# EAGLE design RCM-Comm_v3_W (EAGLE 7.6.0)
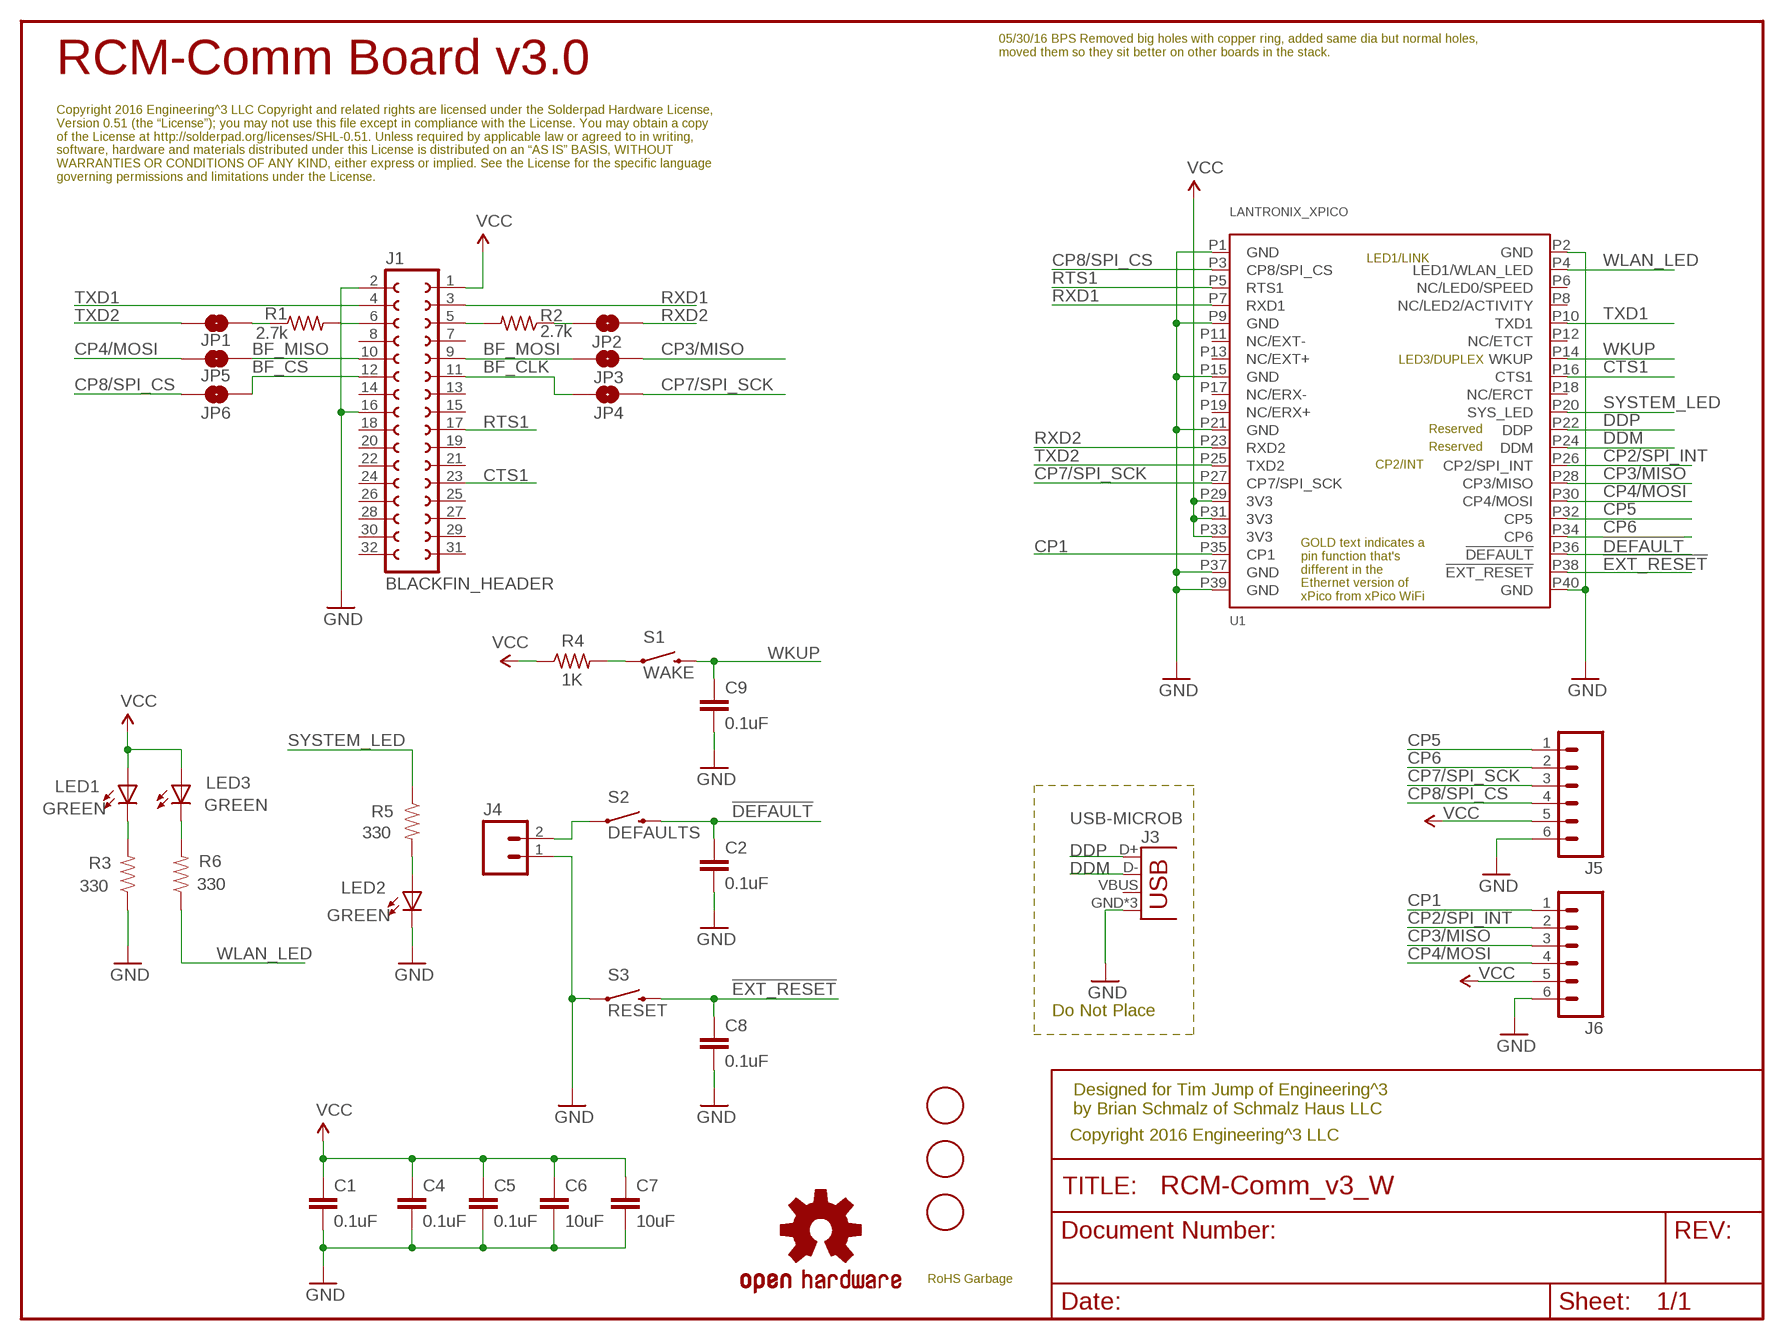
[diagram p0: schematic, sheet 1]

## Parts
C1  0.1uF  0.1UF-25V(+80/-20%)(0603)  [0603-CAP]
C2  0.1uF  0.1UF-25V(+80/-20%)(0603)  [0603-CAP]
C4  0.1uF  0.1UF-25V(+80/-20%)(0603)  [0603-CAP]
C5  0.1uF  0.1UF-25V(+80/-20%)(0603)  [0603-CAP]
C6  10uF  10UF-6.3V-20%(0603)  [0603-CAP]
C7  10uF  10UF-6.3V-20%(0603)  [0603-CAP]
C8  0.1uF  0.1UF-25V(+80/-20%)(0603)  [0603-CAP]
C9  0.1uF  0.1UF-25V(+80/-20%)(0603)  [0603-CAP]
FID1  FIDUCIAL  [FIDUCIAL_1MM]
FID2  FIDUCIAL  [FIDUCIAL_1MM]
FID3  FIDUCIAL  [FIDUCIAL_1MM]
J1  BLACKFIN_HEADER  [2X16]
J3  USB-MICROB  [USB-MICROB]
J4  M02LOCK  [1X02_LOCK]
J5  M06LOCK  [1X06_LOCK]
J6  M06LOCK  [1X06_LOCK]
JP1  JUMPER-PAD-2-NOROUND  [PAD-JUMPER-2-NO_YES_SILK_ROUND]
JP2  JUMPER-PAD-2-NOROUND  [PAD-JUMPER-2-NO_YES_SILK_ROUND]
JP3  JUMPER-PAD-2-NOROUND  [PAD-JUMPER-2-NO_YES_SILK_ROUND]
JP4  JUMPER-PAD-2-NOROUND  [PAD-JUMPER-2-NO_YES_SILK_ROUND]
JP5  JUMPER-PAD-2-NOROUND  [PAD-JUMPER-2-NO_YES_SILK_ROUND]
JP6  JUMPER-PAD-2-NOROUND  [PAD-JUMPER-2-NO_YES_SILK_ROUND]
LED1  GREEN  LED0603  [LED-0603]
LED2  GREEN  LED0603  [LED-0603]
LED3  GREEN  LED0603  [LED-0603]
LOGO1  OSHW-LOGOM  [OSHW-LOGO-M]
R1  2.7k  R-US_R0603  [R0603]
R2  2.7k  R-US_R0603  [R0603]
R3  330  RESISTOR0603-RES  [0603-RES]
R4  1K  R-US_R0603  [R0603]
R5  330  RESISTOR0603-RES  [0603-RES]
R6  330  RESISTOR0603-RES  [0603-RES]
S1  WAKE  SWITCH-MOMENTARY-2SMD  [TACTILE-SWITCH-SMD]
S2  DEFAULTS  SWITCH-MOMENTARY-2SMD  [TACTILE-SWITCH-SMD]
S3  RESET  SWITCH-MOMENTARY-2SMD  [TACTILE-SWITCH-SMD]
U1  LANTRONIX_XPICO  [LANTRONIX_XPICO]
U$3  ROHS_GARBAGE  [ROHS_GARBAGE_5MM]

## Nets
!DEFAULT!: C2.1 S2.3 U1.P36(!DEFAULT!)
!EXT_RESET!: C8.1 S3.3 U1.P38(!EXT_RESET!)
BF_CLK: J1.11(SPI_SCK) JP4.1
BF_CS: J1.12(SPI_SEL) JP6.2
BF_MISO: J1.10(SPI_MISO) JP5.2
BF_MOSI: J1.9(SPI_MOSI) JP3.1
CP1: J6.1 U1.P35(CP1)
CP2/SPI_INT: J6.2 U1.P26(CP2/SPI_INT)
CP3/MISO: J6.3 JP3.2 U1.P28(CP3/MISO)
CP4/MOSI: J6.4 JP5.1 U1.P30(CP4/MOSI)
CP5: J5.1 U1.P32(CP5)
CP6: J5.2 U1.P34(CP6)
CP7/SPI_SCK: J5.3 JP4.2 U1.P27(CP7/SPI_SCK)
CP8/SPI_CS: J5.4 JP6.1 U1.P3(CP8/SPI_CS)
CTS1: J1.23(GP6) U1.P16(CTS1)
DDM: J3.D- U1.P24(DDM)
DDP: J3.D+ U1.P22(DDP)
GND: C1.2 C2.2 C4.2 C5.2 C6.2 C7.2 C8.2 C9.2 J1.2(GND) J1.16(GND16) J3.GND J3.MT1(GND) J3.MT2(GND) J4.1 J5.6 J6.6 LED2.C R3.1 S3.1 U1.P1(GND) U1.P2(GND) U1.P9(GND) U1.P15(GND) U1.P21(GND) U1.P37(GND) U1.P39(GND) U1.P40(GND)
N$1: J4.2 S2.1
N$2: JP1.2 R1.1
N$3: LED1.C R3.2
N$4: JP2.1 R2.1
N$5: R4.2 S1.1
N$6: LED2.A R5.2
N$8: LED3.C R6.2
N$24: J1.6(RX1) R1.2
N$26: J1.5(TX1) R2.2
RTS1: J1.17(GP0) U1.P5(RTS1)
RXD1: J1.3(TX0) U1.P7(RXD1)
RXD2: JP2.2 U1.P23(RXD2)
SYSTEM_LED: R5.1 U1.P20(SYS_LED)
TXD1: J1.4(RX0) U1.P10(TXD1)
TXD2: JP1.1 U1.P25(TXD2)
VCC: C1.1 C4.1 C5.1 C6.1 C7.1 J1.1(3.3V) J5.5 J6.5 LED1.A LED3.A R4.1 U1.P29(3V3) U1.P31(3V3) U1.P33(3V3)
WKUP: C9.1 S1.3 U1.P14(WKUP)
WLAN_LED: R6.1 U1.P4(LED1/WLAN_LED)
Unconnected: J1.7(TMR2) J1.8(TMR3) J1.13(SPI_SEL2) J1.14(SPI_SCL) J1.15(I2C_SDA) J1.18(GP1) J1.19(GP2) J1.20(GP3) J1.21(GP4) J1.22(GP5) J1.24(GP7) J1.25(GP8) J1.26(GP9) J1.27(GPA) J1.28(GPB) J1.29(GPC) J1.30(GPD) J1.31(GPE) J1.32(GPF) J3.VBUS U1.P6(NC/LED0/SPEED) U1.P8(NC/LED2/ACTIVITY) U1.P11(NC/EXT-) U1.P12(NC/ETCT) U1.P13(NC/EXT+) U1.P17(NC/ERX-) U1.P18(NC/ERCT) U1.P19(NC/ERX+)

## Notes on the sheet
- 05/30/16 BPS Removed big holes with copper ring, added same dia but normal holes, 
  moved them so they sit better on other boards in the stack.
- RCM-Comm Board v3.0
- Copyright 2016 Engineering^3 LLC Copyright and related rights are licensed under the Solderpad Hardware License, 
  Version 0.51 (the “License”); you may not use this file except in compliance with the License. You may obtain a copy 
  of the License at http://solderpad.org/licenses/SHL-0.51. Unless required by applicable law or agreed to in writing, 
  software, hardware and materials distributed under this License is distributed on an “AS IS” BASIS, WITHOUT 
  WARRANTIES OR CONDITIONS OF ANY KIND, either express or implied. See the License for the specific language 
  governing permissions and limitations under the License.
- Do Not Place
- Designed for Tim Jump of Engineering^3
  by Brian Schmalz of Schmalz Haus LLC
- Copyright 2016 Engineering^3 LLC

## Library data of the parts
C1 C2 C4 C5 C8 C9 = SparkFun-Capacitors:0.1UF-25V(+80/-20%)(0603): CAP-00810 Ceramic Standard decoupling cap; PROD_ID: CAP-00810
C6 C7 = SparkFun-Capacitors:10UF-6.3V-20%(0603): CAP-11015; PROD_ID: CAP-11015
FID1-FID3 = adafruit:FIDUCIAL: For use by pick and place machines to calibrate the vision/machine, 1mm By microbuilder.eu
J1 = Surveyor:BLACKFIN_HEADER
J3 = SparkFun-Connectors:USB: USB Connectors USB-B-PTH is fully proven SKU : PRT-00139/CONN-08278 USB-miniB is fully proven SKU : PRT-00587 USB-A-PCB is untested. USB-A-H is throughly reviewed, but untested. Spark Fun Electronics SKU : PRT-00437 USB-B-SMT is throughly reviewed, but untested. Needs silkscreen touching up. USB-A-S has not been used/tested USB-MB-H has not been used/tested USB-MICROB has been used. CONN-09505; PROD_ID: CONN-09505
J4 = SparkFun-Connectors:M02: Standard 2-pin 0.1" header. Use with - straight break away headers ( PRT-00116) - right angle break away headers (PRT-00553) - swiss pins (PRT-00743) - machine pins (PRT-00117) - female headers (PRT-00115) Molex polarized connector foot print use with: PRT-08233 with associated crimp pins and housings. 2.54_SCREWTERM for use with PRT-10571. 3.5mm Screw Terminal footprints for PRT-08084 5mm Screw Terminal footprints for use with PRT-08432
J5 J6 = SparkFun-Connectors:M06: Header 6 Standard 6-pin 0.1" header. Use with straight break away headers (SKU : PRT-00116), right angle break away headers (PRT-00553), swiss pins (PRT-00743), machine pins (PRT-00117), and female headers (PRT-00115). Molex polarized connector foot print use with SKU : PRT-08094 with associated crimp pins and housings. NOTES ON THE VARIANTS LOCK and LOCK_LONGPADS... This footprint was designed to help hold the alignment of a through-hole component (i.e. 6-pin header) while soldering it into place. You may notice that each hole has been shifted either up or down by 0.005 of an inch from it's more standard position (which is a perfectly straight line). This slight alteration caused the pins (the squares in the middle) to touch the edges of the holes. Because they are alternating, it causes a "brace" to hold the component in place. 0.005 has proven to be the perfect amount of "off-center" position when using our standard breakaway headers. Although looks a little odd when you look at the bare footprint, once you have a header in there, the alteration is very hard to notice. Also,if you push a header all the way into place, it is covered up entirely on the bottom side. This idea of altering the position of holes to aid alignment will be further integrated into the Sparkfun Library for other footprints. It can help hold any component with 3 or more connection pins.
JP1-JP6 = SparkFun-Passives:JUMPER-PAD-2-NO
LED1-LED3 = spark_fun:LED: LEDs Standard schematic elements and footprints for 5mm, 3mm, 1206, and 0603 sized LEDs. 5mm - Spark Fun Electronics SKU : COM-00529 (and others)
LOGO1 = SparkFun-Aesthetics:OSHW-LOGO: Open Source Hardware Logo This logo indicates the piece of hardware it is found on incorporates a OSHW license and/or adheres to the definition of open source hardware found here: http://freedomdefined.org/OSHW
R1 R2 R4 = rcl:R-US_: RESISTOR, American symbol
R3 R5 R6 = spark_fun:RESISTOR: Resistor Basic schematic elements and footprints for 0603, 1206, and PTH resistors.
S1-S3 = SparkFun-Electromechanical:SWITCH-MOMENTARY-2: Various NO switches- pushbuttons, reed, etc; PROD_ID: SWCH-08247
U1 = xPico:LANTRONIX_XPICO
U$3 = SchmalzHausPublic:ROHS_GARBAGE

## Board
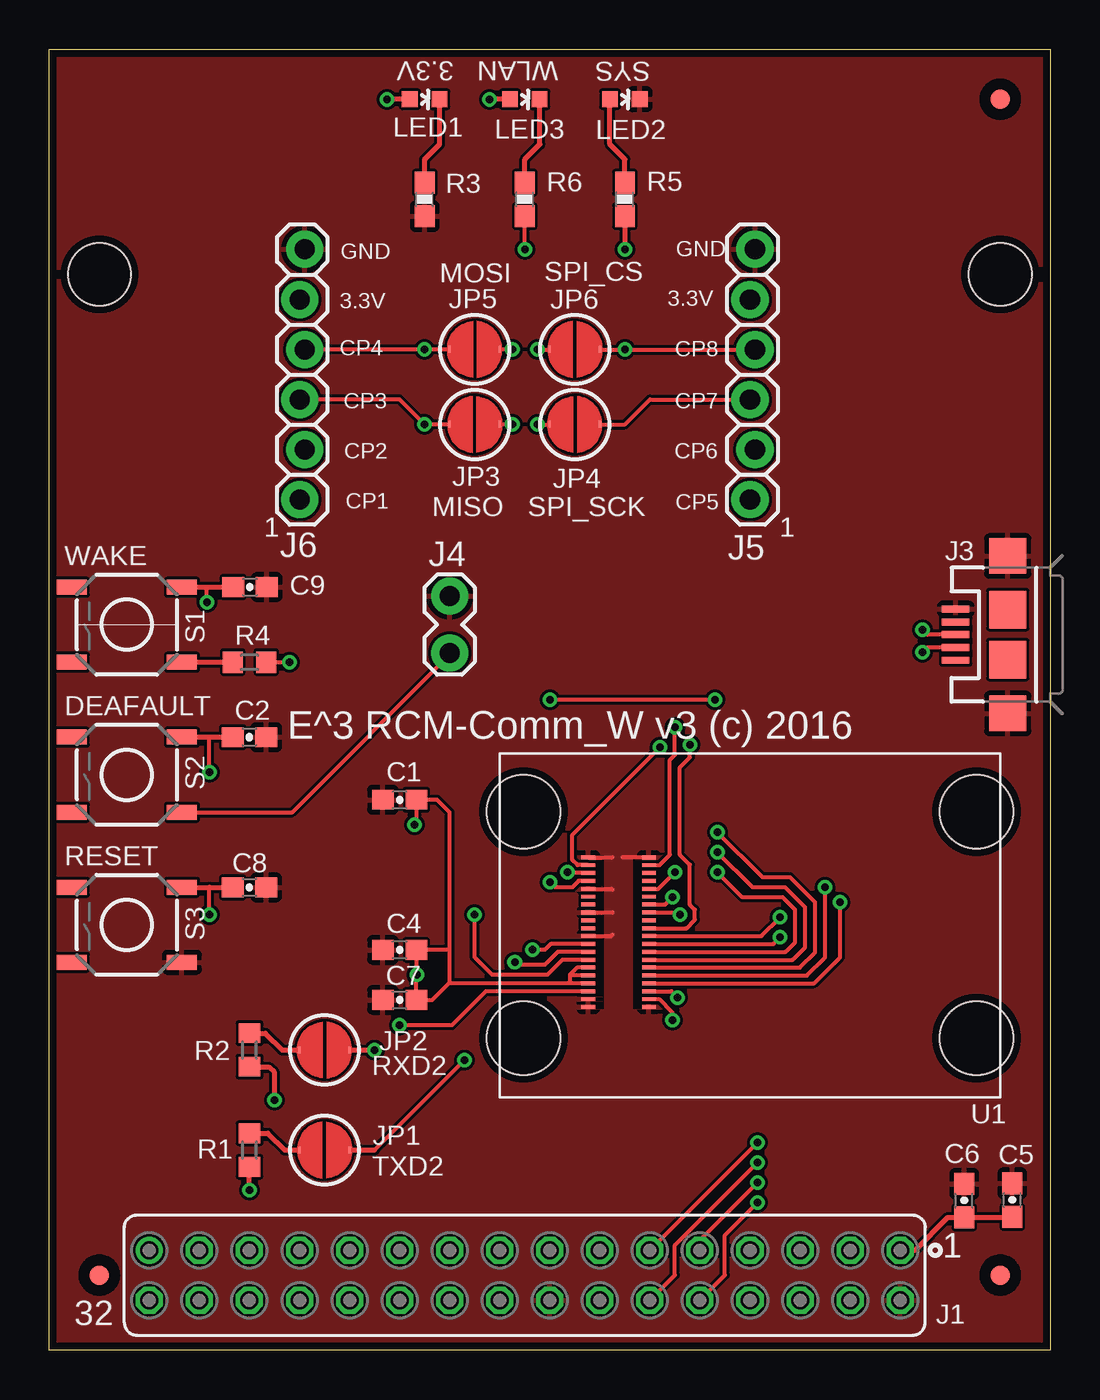
[diagram p1: board, top side]
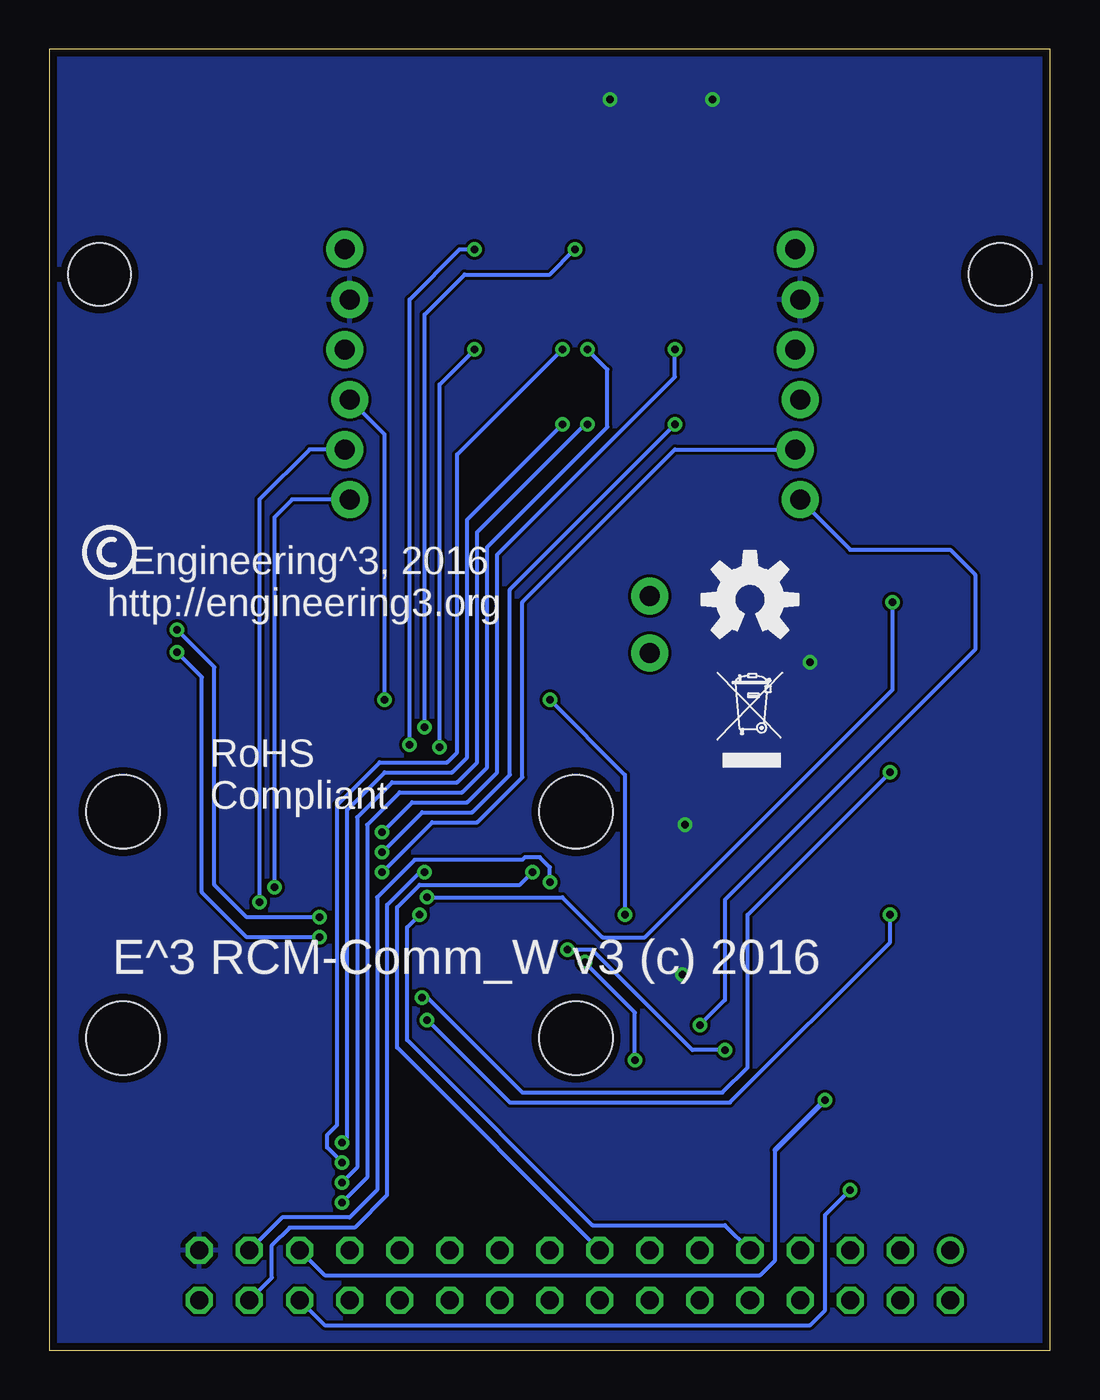
[diagram p2: board, bottom side, seen from below]

Size 50.8 x 66.05 mm. Coordinates in mm from the lower left corner, seen from the top.
Outline: 0,66.05 50.8,66.05 50.8,43.69 50.8,0 0,0.01 0,66.05
Copper layers (1*16): Top 0.0356mm / dielectric 1.5011mm / Bottom 0.0356mm
Design rules "LaenPCBOrder": minimum track width 6mil, minimum drill 13mil, track to track 6mil, track to pad 6mil, pad to pad 6mil, via to via 6mil, smd to smd 6mil, copper to edge 15mil, drill to drill 6mil, minimum pad ring 7mil, minimum via ring 7mil, stop-mask expansion 3mil, vias tented up to drill 25mil, thermal gap 10mil
Holes 3.17 mm at 2.54,54.62 48.26,54.62

### Footprints (pad centres in the part's own frame; a part is rotated, then mirrored left to right if it is on the bottom)
0603-CAP = smd 1.1 x 1: 1 -0.85,0; 2 0.85,0
FIDUCIAL_1MM = smd 1 x 1: 1 0,0
2X16 = drill 0.914 octagon: 1 20.32,1.27; 2 20.32,-1.27; 3 17.78,1.27; 4 17.78,-1.27; 5 15.24,1.27; 6 15.24,-1.27; 7 12.7,1.27; 8 12.7,-1.27; 9 10.16,1.27; 10 10.16,-1.27; 11 7.62,1.27; 12 7.62,-1.27; 13 5.08,1.27; 14 5.08,-1.27; 15 2.54,1.27; 16 2.54,-1.27; 17 0,1.27; 18 0,-1.27; 19 -2.54,1.27; 20 -2.54,-1.27; 21 -5.08,1.27; 22 -5.08,-1.27; 23 -7.62,1.27; 24 -7.62,-1.27; 25 -10.16,1.27; 26 -10.16,-1.27; 27 -12.7,1.27; 28 -12.7,-1.27; 29 -15.24,1.27; 30 -15.24,-1.27; 32 -17.78,-1.27 | drill 0.914: 31 -17.78,1.27
USB-MICROB = smd 0.35 x 1.4: D+ 0,2.65; D- -0.65,2.65; GND 1.3,2.65; ID 0.65,2.65; VBUS -1.3,2.65 | smd 1.8 x 1.9: MT1 -4,0; MT2 4,0 | smd 1.9 x 1.9: P$1 -1.27,0; P$2 1.27,0
1X02_LOCK = drill 1.016 pad 1.88: 1 -0.178,0; 2 2.718,0
1X06_LOCK = drill 1.016 pad 1.88: 1 0,0; 2 2.54,-0.254; 3 5.08,0; 4 7.62,-0.254; 5 10.16,0; 6 12.7,-0.254
PAD-JUMPER-2-NO_YES_SILK_ROUND = smd 0.152 x 0.305: 1 -1.27,0; 2 1.27,0
LED-0603 = smd 0.8 x 0.8: A 0,-0.75; C 0,0.75
R0603 = smd 1 x 1.1: 1 -0.85,0; 2 0.85,0
0603-RES = smd 1.1 x 1: 1 -0.85,0; 2 0.85,0
TACTILE-SWITCH-SMD = smd 1.524 x 0.762: 1 -2.794,1.905; 2 2.794,1.905; 3 -2.794,-1.905; 4 2.794,-1.905
LANTRONIX_XPICO = smd 0.7 x 0.2: P1 -8.21,3.43; P2 -5.13,3.43; P3 -8.21,3.03; P4 -5.13,3.03; P5 -8.21,2.63; P6 -5.13,2.63; P7 -8.21,2.23; P8 -5.13,2.23; P9 -8.21,1.83; P10 -5.13,1.83; P11 -8.21,1.43; P12 -5.13,1.43; P13 -8.21,1.03; P14 -5.13,1.03; P15 -8.21,0.63; P16 -5.13,0.63; P17 -8.21,0.23; P18 -5.13,0.23; P19 -8.21,-0.17; P20 -5.13,-0.17; P21 -8.21,-0.57; P22 -5.13,-0.57; P23 -8.21,-0.97; P24 -5.13,-0.97; P25 -8.21,-1.37; P26 -5.13,-1.37; P27 -8.21,-1.77; P28 -5.13,-1.77; P29 -8.21,-2.17; P30 -5.13,-2.17; P31 -8.21,-2.57; P32 -5.13,-2.57; P33 -8.21,-2.97; P34 -5.13,-2.97; P35 -8.21,-3.37; P36 -5.13,-3.37; P37 -8.21,-3.77; P38 -5.13,-3.77; P39 -8.21,-4.17; P40 -5.13,-4.17 | hole 3.73: -11.5,5.75; -11.5,-5.75; 11.5,5.75; 11.5,-5.75

### Placement (x,y rotation side)
C1  17.78,27.95 180 top
C2  10.16,31.12 0 top
C4  17.78,20.32 180 top
C5  48.87,7.62 90 top
C6  46.43,7.6 90 top
C7  17.78,17.79 180 top
C8  10.16,23.5 0 top
C9  10.19,38.74 0 top
FID1  2.54,3.81 0 top
FID2  48.26,63.51 0 top
FID3  48.26,3.81 0 top
J1  22.86,3.81 0 top
J3  48.64,36.33 90 top
J4  20.32,38.11 270 top
J5  35.56,43.19 90 top
J6  12.7,43.19 90 top
JP1  13.97,10.17 180 top
JP2  13.97,15.25 0 top
JP3  21.59,47 180 top
JP4  26.67,47 0 top
JP5  21.59,50.8 0 top
JP6  26.67,50.8 180 top
LED1  19.05,63.51 270 top
LED2  29.21,63.51 270 top
LED3  24.13,63.51 270 top
LOGO1  15.24,38.11 0 bottom
R1  10.16,10.17 270 top
R2  10.16,15.25 270 top
R3  19.05,58.43 90 top
R4  10.16,34.93 180 top
R5  29.21,58.43 90 top
R6  24.13,58.43 90 top
S1  3.94,36.84 180 top
S2  3.94,29.21 180 top
S3  3.94,21.59 180 top
U1  35.56,21.59 0 top
U$3  16.89,29.6 0 bottom

### Tracks (layer width: path | path; a pad name or v marks a point on that pad's centre or on a via)
!DEFAULT!  (via drill 0.38)
  Top 0.203: U1.P36 31.56,18.22 v31.88,17.91 | v8.13,29.34 8.13,31.12
  Top 0.254: S2.3 8.13,31.12 C2.1
  Bottom 0.203: v31.88,17.91 31.62,17.91 26.8,13.09 16.64,13.09 15.37,14.36 15.37,22.1 v8.13,29.34
!EXT_RESET!  (via drill 0.38)
  Top 0.203: U1.P38 30.95,17.82 31.62,17.15 v31.62,16.77 | v8.13,22.1 8.13,23.5
  Top 0.254: S3.3 8.13,23.5 C8.1
  Bottom 0.203: v8.13,22.1 8.13,20.71 16.26,12.58 27.43,12.58 v31.62,16.77
BF_CLK  (via drill 0.38)
  Top 0.203: J1.11 v35.94,10.55 | v24.77,47 JP4.1
  Bottom 0.203: v35.94,10.55 35.69,10.8 35.69,27.44 33.78,29.34 30.35,29.34 29.59,30.1 29.59,42.17 v24.77,47
BF_CS  (via drill 0.38)
  Top 0.203: J1.12 31.75,3.81 31.75,5.34 v35.94,9.53 | v24.77,50.8 JP6.2
  Bottom 0.203: v35.94,9.53 36.7,10.29 36.7,10.93 36.2,11.44 36.2,27.69 34.04,29.85 30.61,29.85 30.1,30.36 30.1,45.47 v24.77,50.8
BF_MISO  (via drill 0.38)
  Top 0.203: J1.10 34.29,3.81 34.29,5.85 v35.94,7.5 | v23.5,50.8 JP5.2
  Bottom 0.203: v35.94,7.5 34.67,8.77 34.67,26.68 33.02,28.33 29.84,28.33 28.57,29.6 28.57,40.77 22.48,46.87 22.48,49.79 v23.5,50.8
BF_MOSI  (via drill 0.38)
  Top 0.203: J1.9 33.02,5.59 v35.94,8.51 | v23.5,47 JP3.1
  Bottom 0.203: v35.94,8.51 35.18,9.28 35.18,27.06 33.4,28.83 30.1,28.83 29.08,29.85 29.08,41.53 23.62,47 v23.5,47
CP1  (via drill 0.38)
  Top 0.203: v17.78,16.52 20.45,16.52 22.16,18.22 U1.P35
  Bottom 0.203: v17.78,16.52 16.51,17.79 16.51,22.86 3.81,35.57 3.81,39.38 5.08,40.65 10.16,40.65 J6.1
CP2/SPI_INT  (via drill 0.38)
  Top 0.203: U1.P26 37.37,20.22 37.85,20.71 37.85,22.36 37.21,22.99 35.18,22.99 v33.91,24.26
  Bottom 0.203: v33.91,24.26 31.37,26.8 29.08,26.8 26.8,29.09 26.8,37.98 19.05,45.73 13.08,45.73 J6.2
CP3/MISO  (via drill 0.38)
  Top 0.203: U1.P28 37.73,19.82 38.35,20.45 38.35,22.48 37.34,23.5 35.69,23.5 v33.91,25.28 | JP3.2 v19.05,47 17.78,48.27 J6.3
  Bottom 0.203: v33.91,25.28 31.88,27.31 29.34,27.31 27.43,29.21 27.43,38.61 v19.05,47
CP4/MOSI  (via drill 0.38)
  Top 0.203: U1.P30 38.09,19.43 38.86,20.2 38.86,22.74 37.59,24.01 36.2,24.01 v33.91,26.29 | JP5.1 v19.05,50.8 J6.4
  Bottom 0.203: v33.91,26.29 32.38,27.82 29.59,27.82 28.07,29.34 28.07,40.39 19.05,49.41 v19.05,50.8
CP5  (via drill 0.38)
  Top 0.203: U1.P32 38.45,19.02 39.37,19.94 v39.37,23.5 39.37,22.99
  Bottom 0.203: v39.37,23.5 39.37,42.3 38.48,43.19 J5.1
CP6  (via drill 0.38)
  Top 0.203: U1.P34 38.81,18.62 40.13,19.94 v40.13,22.74
  Bottom 0.203: J5.2 37.59,45.73 40.13,43.19 v40.13,22.74
CP7/SPI_SCK  (via drill 0.38)
  Top 0.203: U1.P27 26.04,19.82 25.27,19.05 22.48,19.05 21.59,19.94 v21.59,22.1 | JP4.2 29.21,47 30.48,48.27 J5.3 | v25.4,33.03 v33.78,33.03
  Bottom 0.203: v21.59,22.1 21.59,29.21 v25.4,33.03 | v33.78,33.03 33.78,46.49 J5.3
CP8/SPI_CS  (via drill 0.38)
  Top 0.203: U1.P3 26.82,24.62 26.54,24.9 26.54,26.17 v30.99,30.61 | JP6.1 v29.21,50.8 J5.4
  Bottom 0.203: v29.21,50.8 30.99,49.03 v30.99,30.61
CTS1  (via drill 0.38)
  Top 0.203: v32,22.1 31.88,22.23 31.87,22.22 U1.P16
  Bottom 0.203: v32,22.1 32.64,21.47 32.64,15.75 23.24,6.35 16.51,6.35 J1.23
DDM  (via drill 0.38)
  Top 0.203: U1.P24 36.75,20.62 v37.08,20.96 | J3.D- 44.56,35.68 v44.32,35.44
  Bottom 0.203: v37.08,20.96 40.77,20.96 43.05,23.25 43.05,34.17 v44.32,35.44
DDP  (via drill 0.38)
  Top 0.203: U1.P22 36.13,21.02 v37.08,21.98 | J3.D+ 44.58,36.33 v44.32,36.58
  Bottom 0.203: v37.08,21.98 40.77,21.98 42.42,23.63 42.42,34.68 v44.32,36.58
GND
  Top 0.203: U1.P21 28.51,21.02 28.57,21.09 | U1.P15 28.57,22.22 28.57,22.23 | U1.P9 28.52,23.43 28.57,23.37 | U1.P1 28.57,25.02 | U1.P2 29.08,25.02
  pour Top: 0,66.05 50.8,66.05 50.8,0.01 0,0.01
N$1
  Top 0.203: S2.1 12.32,27.31 20.32,35.31 J4.2
N$2
  Top 0.254: R1.1 11.09,11.02 11.94,10.17 JP1.2 13.34,10.17
N$3
  Top 0.254: R3.2 19.05,60.46 19.81,61.22 19.81,63.49 LED1.C
N$4
  Top 0.254: R2.1 10.96,16.09 11.81,15.25 JP2.1
N$5
  Top 0.254: S1.1 R4.2
N$6
  Top 0.254: R5.2 29.21,60.46 28.45,61.22 28.45,63.38 28.32,63.51 LED2.A
N$8
  Top 0.254: R6.2 24.13,60.46 24.89,61.22 24.89,63.49 LED3.C
N$24  (via drill 0.38)
  Top 0.254: v10.16,8.13 R1.2
  Bottom 0.203: J1.6 36.83,1.27 12.19,1.27 11.43,2.04 11.43,6.86 v10.16,8.13
N$26  (via drill 0.38)
  Top 0.254: v11.43,12.71 11.43,14.1 11.18,14.36 10.29,14.36 10.16,14.48 R2.2
  Bottom 0.203: J1.5 36.83,3.81 14.73,3.81 13.97,4.58 13.97,10.17
  Bottom 0.254: 13.97,10.17 v11.43,12.71
RTS1  (via drill 0.38)
  Top 0.203: U1.P5 26.33,24.22 v26.29,24.26
  Bottom 0.203: J1.17 33.15,15.37 33.15,22.48 32,23.63 26.92,23.63 v26.29,24.26
RXD1  (via drill 0.38)
  Top 0.203: U1.P7 26.85,23.82 26.85,23.81 26.54,23.5 25.65,23.5 v25.4,23.75
  Bottom 0.203: v25.4,23.75 25.4,24.52 25.91,25.02 26.67,25.02 26.8,24.9 32.26,24.9 34.16,22.99 34.16,8.13 35.56,6.74 38.99,6.74 J1.3
RXD2  (via drill 0.38)
  Top 0.203: U1.P23 25.45,20.62 25.15,20.32 v24.51,20.32
  Top 0.254: JP2.2 v16.51,15.25
  Bottom 0.203: v16.51,15.25 18.16,15.25 23.24,20.32 v24.51,20.32
SYSTEM_LED  (via drill 0.38)
  Top 0.203: U1.P20 32.34,21.43 32.77,21.85 32.77,22.36 32.51,22.61 32.51,24.64 32,25.15 32,29.6 32.51,30.1 v32.51,30.74
  Top 0.254: R5.1 v29.21,55.89
  Bottom 0.203: v32.51,30.74 32.51,53.35 29.97,55.89 v29.21,55.89
TXD1  (via drill 0.38)
  Top 0.203: U1.P10 30.91,23.43 v31.75,24.26
  Bottom 0.203: J1.4 39.5,3.69 39.5,5.34 38.61,6.23 35.31,6.23 33.66,7.88 33.66,22.61 32,24.26 v31.75,24.26
TXD2  (via drill 0.38)
  Top 0.203: 16.51,10.17 v21.08,14.74 | U1.P25 25.81,20.22 25.15,19.56 23.75,19.56 v23.62,19.69
  Top 0.254: JP1.1 16.51,10.17
  Bottom 0.203: v21.08,14.74 21.08,17.15 v23.62,19.69
VCC  (via drill 0.38)
  Top 0.203: U1.P33 26.42,18.62 | 20.32,18.67 19.43,17.79 C7.1 18.63,19.02 v18.67,19.05 18.63,19.09 C4.1 20.32,20.32 | 20.32,18.67 20.32,20.32 | 20.32,20.32 20.32,27.31 19.69,27.95 C1.1 18.63,26.76 v18.54,26.68 | U1.P29 26.79,19.43 26.42,19.05 | 26.42,19.05 26.42,18.62 | U1.P31 26.45,19.02 26.42,19.05 | R4.1 v12.19,34.93 | 26.42,18.62 20.37,18.62 20.32,18.67
  Top 0.254: J1.1 43.94,5.08 45.59,6.74 46.42,6.74 C6.1 48.84,6.75 C5.1 | LED1.A v17.14,63.51 | LED3.A v22.35,63.51
  pour Bottom: 0,66.05 50.8,66.05 50.8,0.01 0,0.01
WKUP  (via drill 0.38)
  Top 0.203: U1.P14 31.26,22.62 v31.62,22.99 | v8,37.98 8,38.74
  Top 0.254: S1.3 8,38.74 C9.1
  Bottom 0.203: v31.62,22.99 24.77,22.99 22.73,20.96 20.57,20.96 8,33.53 v8,37.98
WLAN_LED  (via drill 0.38)
  Top 0.203: U1.P4 30.97,24.62 31.5,25.15 31.5,29.98 31.75,30.23 v31.75,31.63 | v24.13,55.89 R6.1
  Bottom 0.203: v31.75,31.63 31.75,52.58 29.72,54.62 25.4,54.62 v24.13,55.89

### Text on the board
tPlace: 3.3V | WLAN | SYS | GND | GND | MOSI | SPI_CS | 3.3V | 3.3V | CP4 | CP8 | CP3 | CP7 | CP2 | CP6 | CP1 | CP5 | MISO | SPI_SCK | 1 | 1 | WAKE | DEAFAULT | E^3 RCM-Comm_W v3 (c) 2016 | RESET | RXD2 | TXD2
bPlace: Engineering^3, 2016 / http://engineering3.org | RoHS / Compliant | E^3 RCM-Comm_W v3 (c) 2016